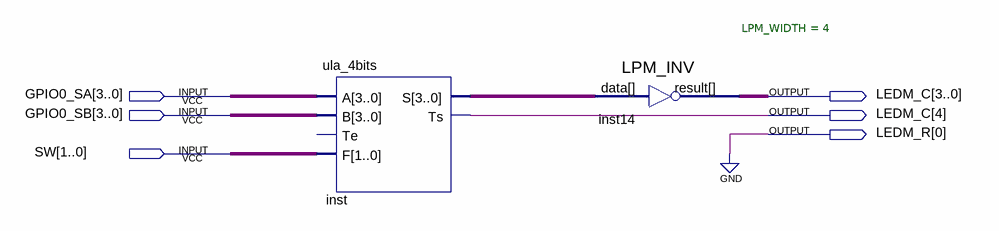
[diagram p0: schematic sheet]
// Quartus schematic fpga_exercicio5.bdf as structural Verilog: 2 symbols, 6 pins
module fpga_exercicio5 (
  input  [3:0] GPIO0_SA,
  input  [3:0] GPIO0_SB,
  input  [1:0] SW,
  output [4:0] LEDM_C,
  output [0:0] LEDM_R
);

  wire [3:0] inst_s;

  ula_4bits inst (.A(GPIO0_SA), .B(GPIO0_SB), .F(SW), .S(inst_s), .Ts(LEDM_C[4]));  // open: Te
  LPM_INV #(.LPM_WIDTH(4)) inst14 (.data(inst_s), .result(LEDM_C[3:0]));

  assign LEDM_R[0] = 1'b0;
endmodule
